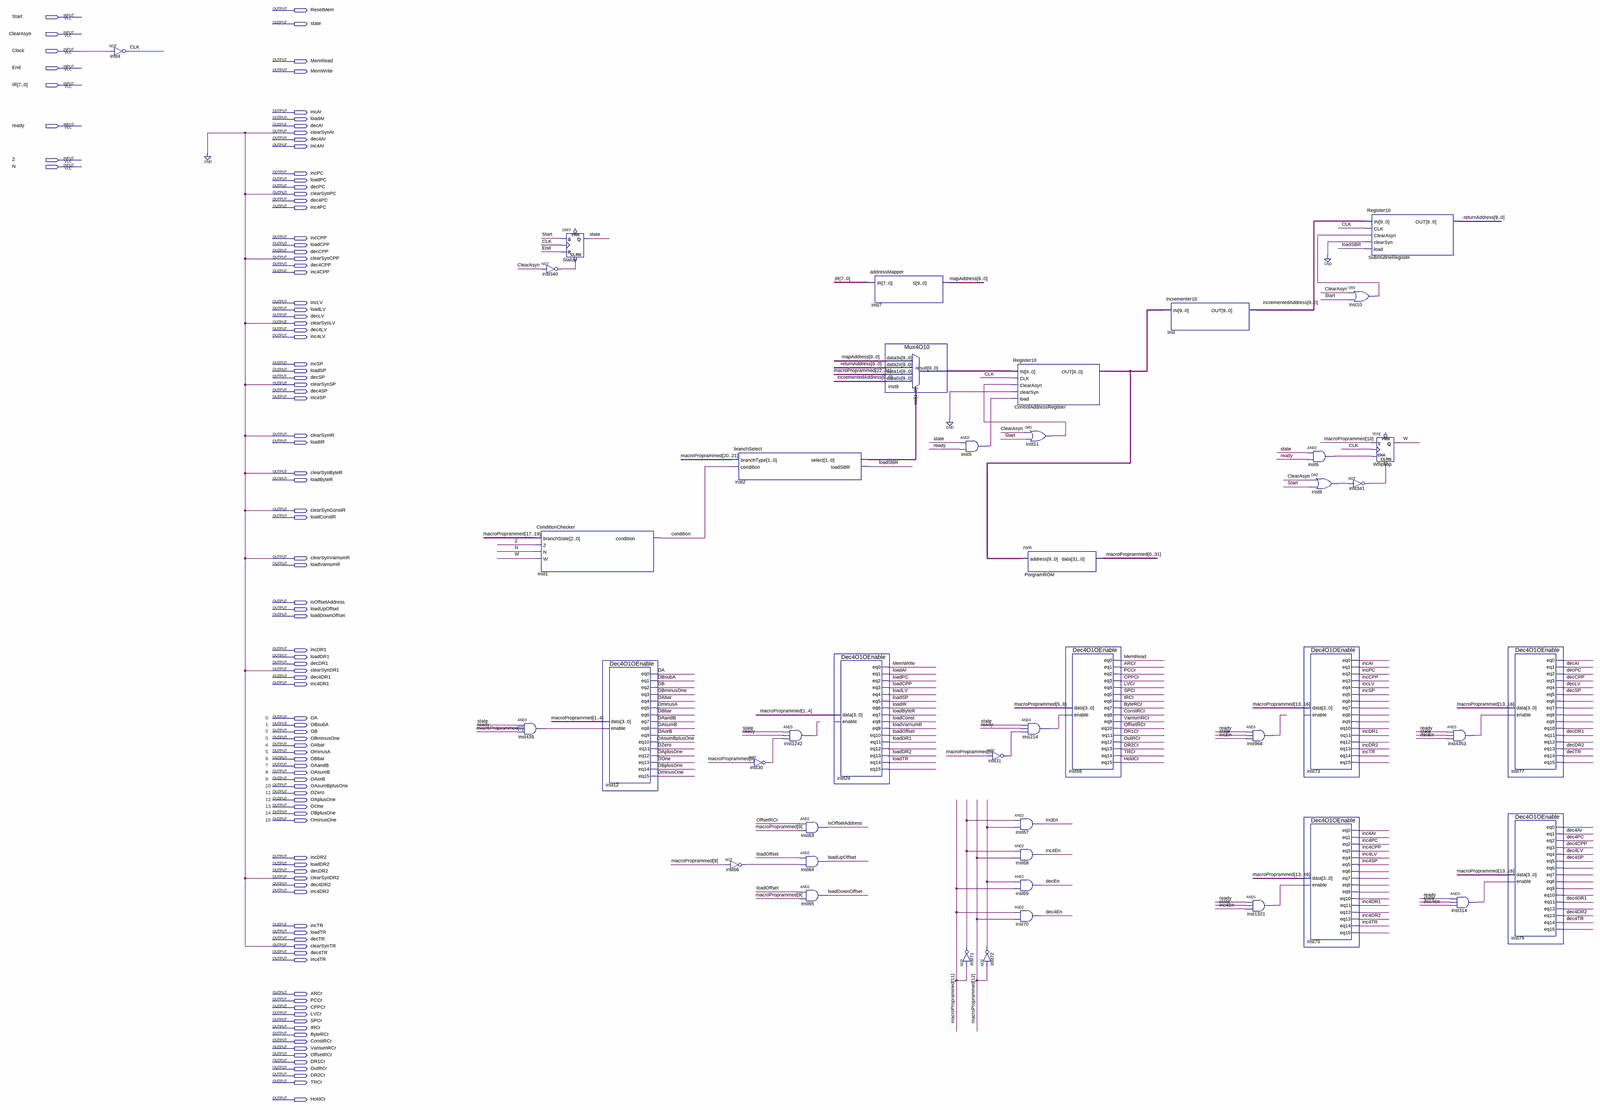
[diagram p0: schematic sheet, whole]
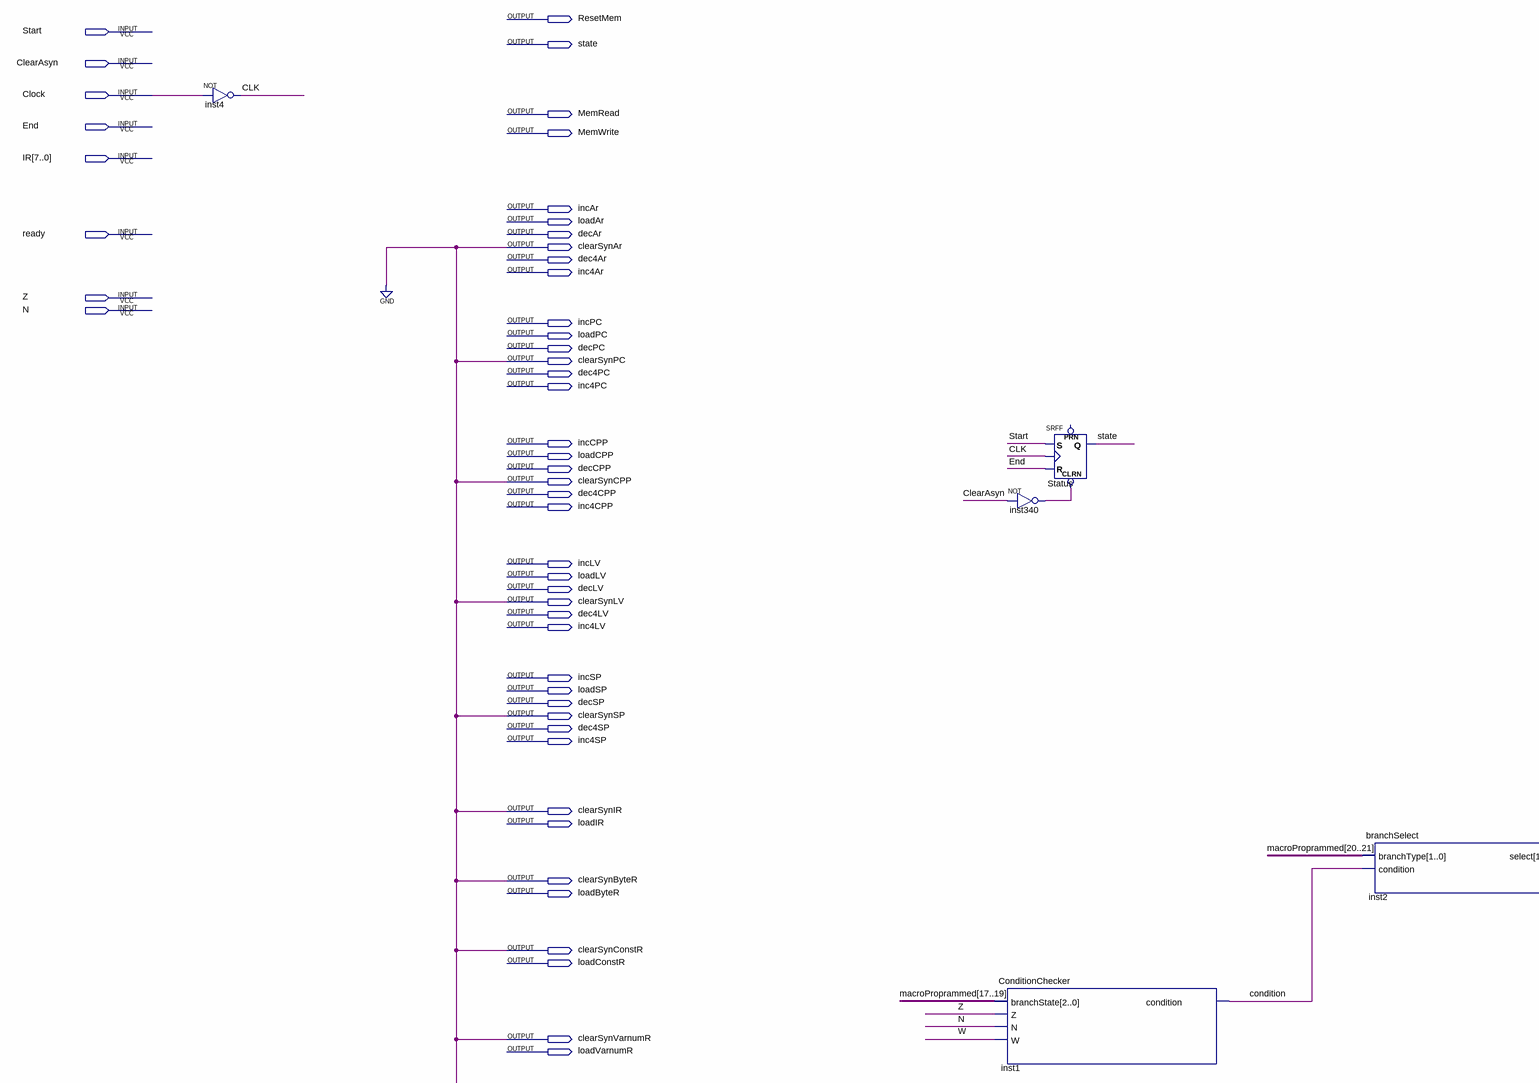
[diagram p1: schematic sheet, upper left part]
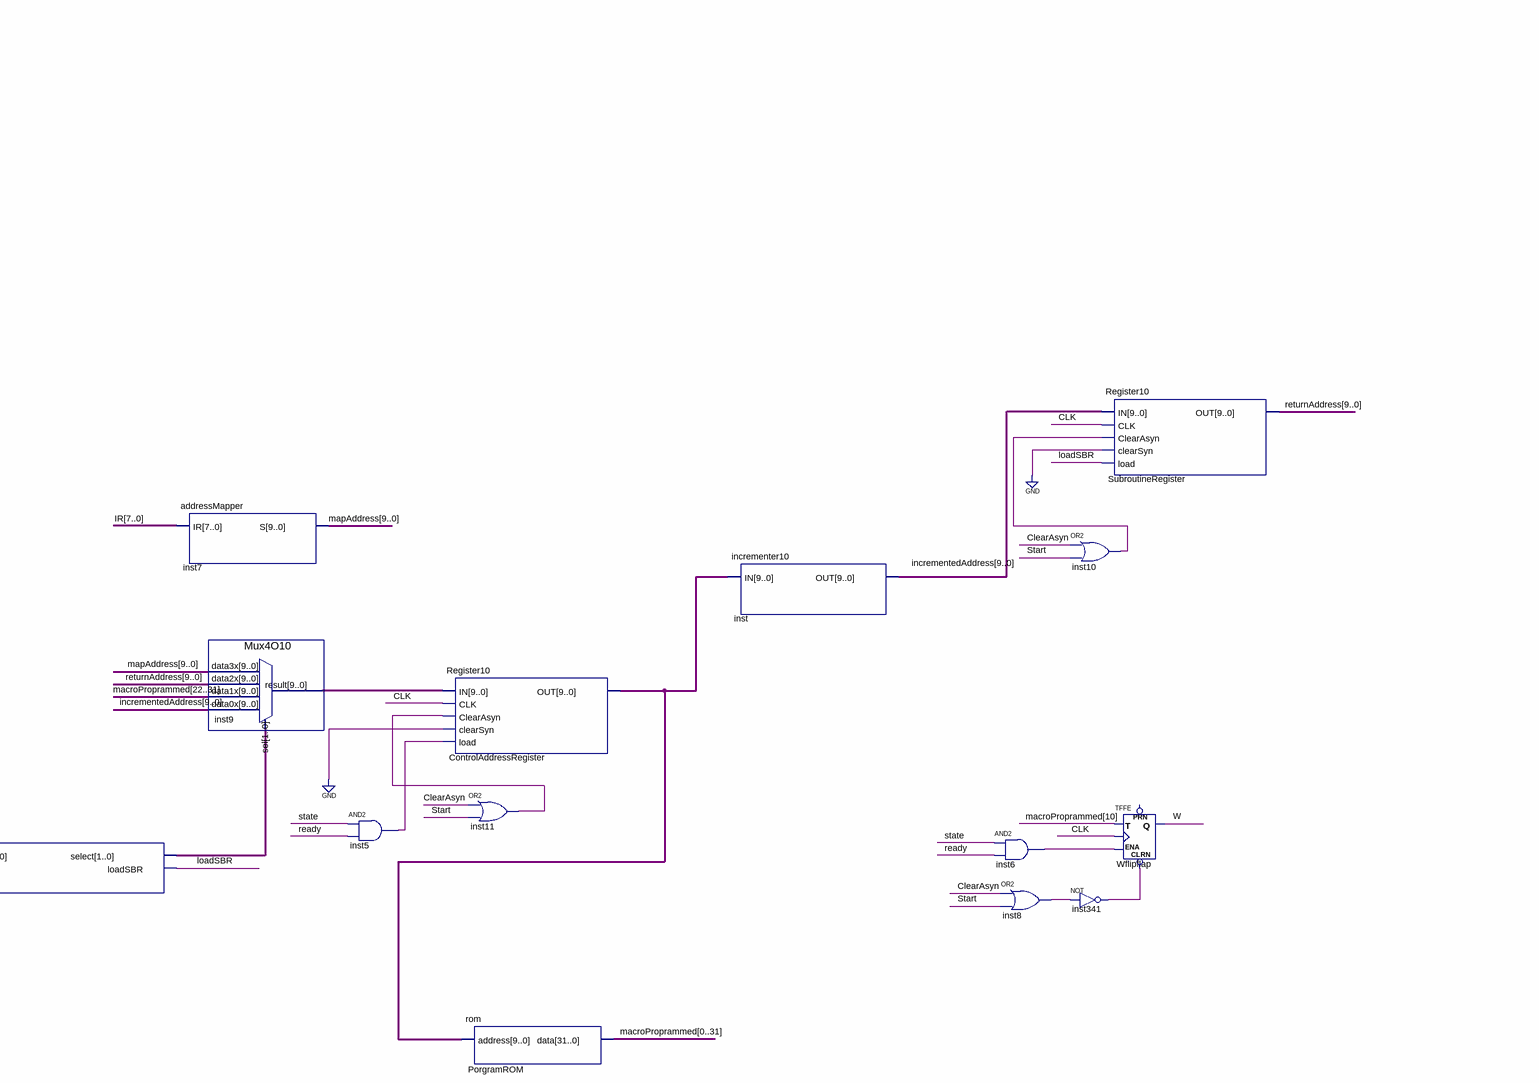
[diagram p2: schematic sheet, upper right part]
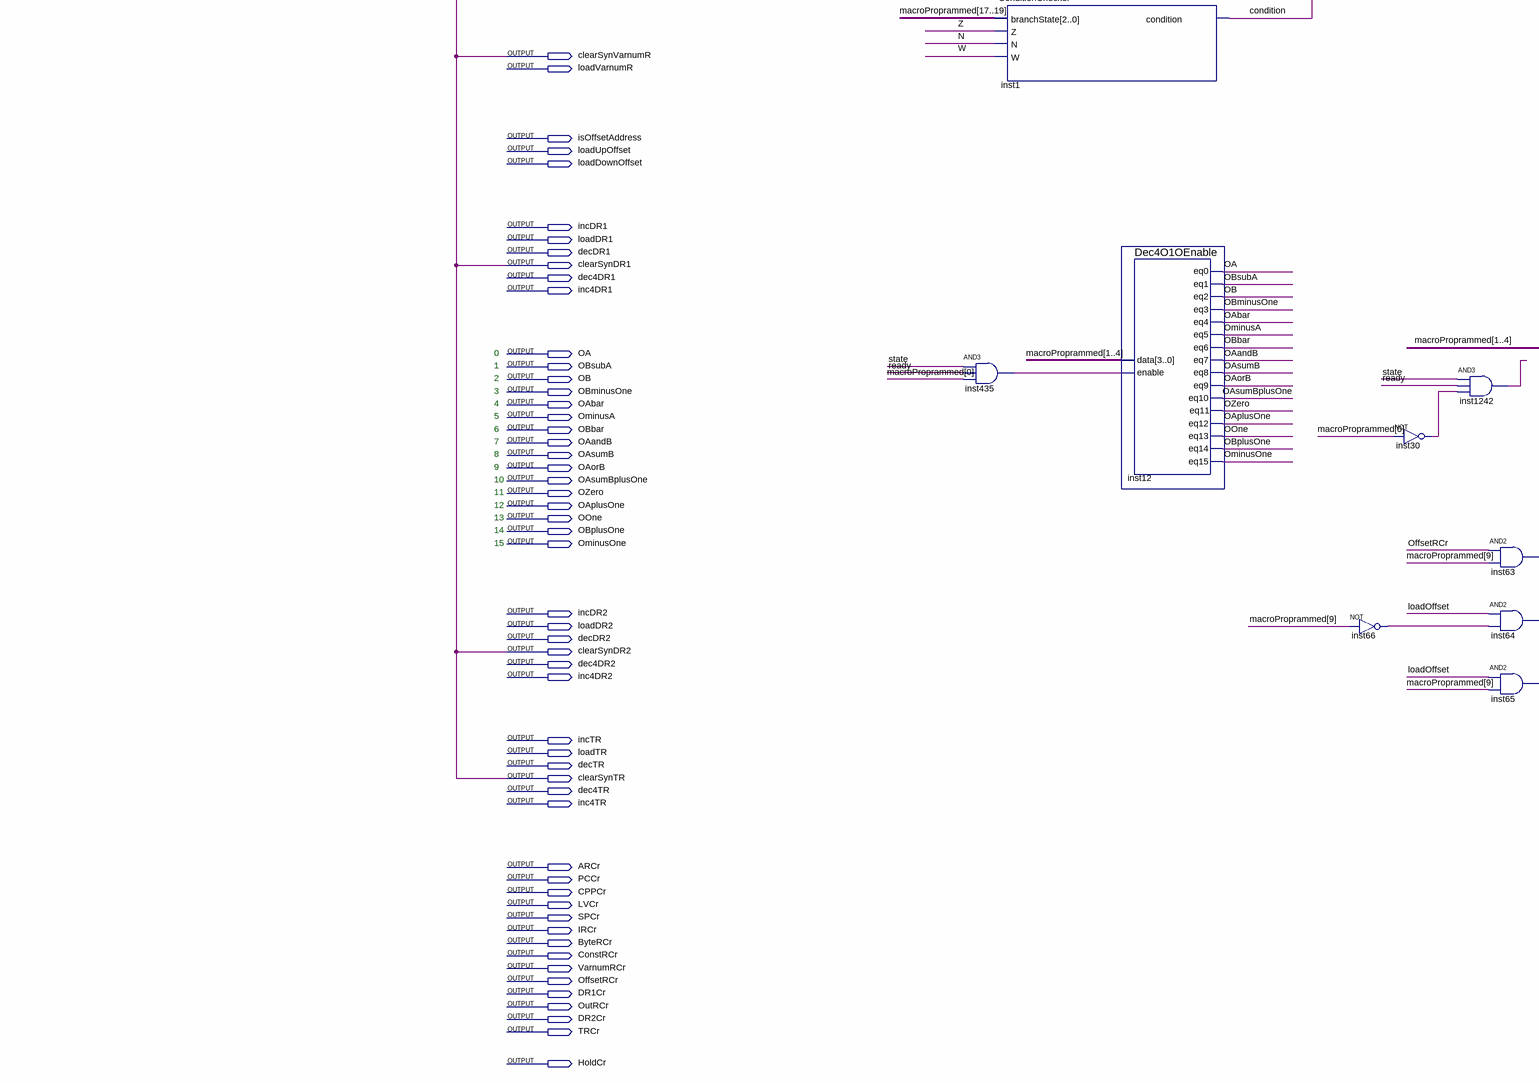
[diagram p3: schematic sheet, lower left part]
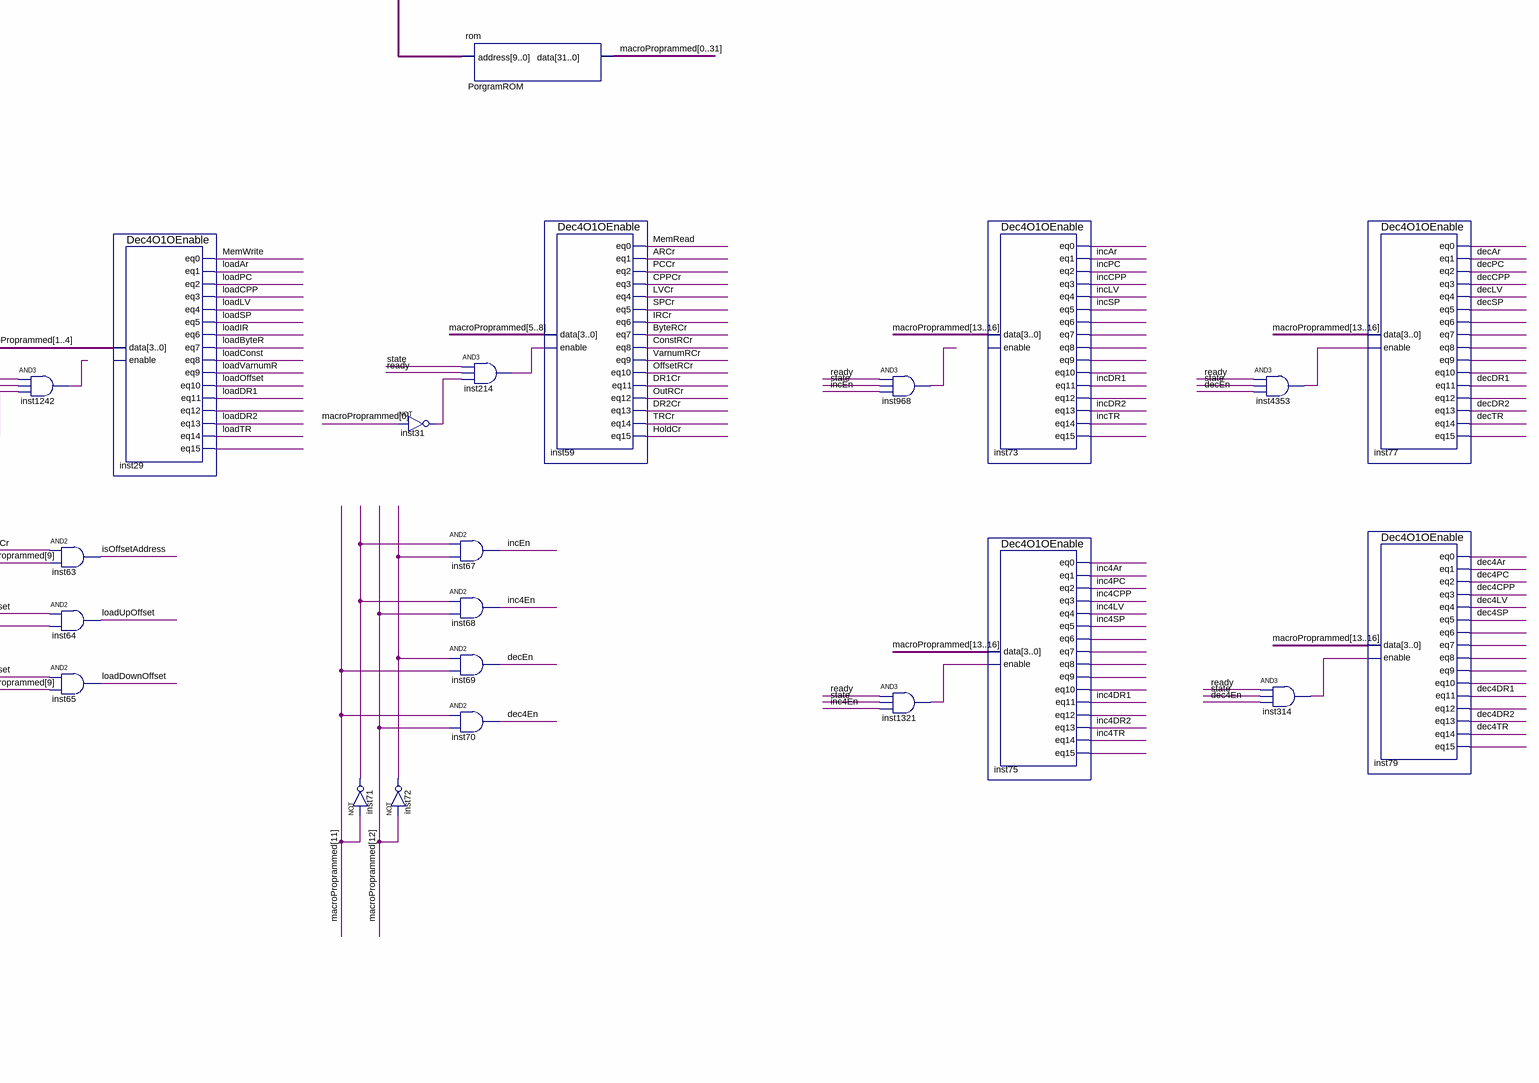
[diagram p4: schematic sheet, lower right part]
// Quartus schematic CU2.bdf as structural Verilog: 44 symbols, 102 pins
module CU2 (
  input  Start,
  input  ClearAsyn,
  input  Clock,
  input  End,
  input  [7:0] IR,
  input  ready,
  input  Z,
  input  N,
  output ResetMem,
  output state,
  output MemRead,
  output MemWrite,
  output incAr,
  output loadAr,
  output decAr,
  output clearSynAr,
  output dec4Ar,
  output inc4Ar,
  output incPC,
  output loadPC,
  output decPC,
  output clearSynPC,
  output dec4PC,
  output inc4PC,
  output incCPP,
  output loadCPP,
  output decCPP,
  output clearSynCPP,
  output dec4CPP,
  output inc4CPP,
  output incLV,
  output loadLV,
  output decLV,
  output clearSynLV,
  output dec4LV,
  output inc4LV,
  output incSP,
  output loadSP,
  output decSP,
  output clearSynSP,
  output dec4SP,
  output inc4SP,
  output clearSynIR,
  output loadIR,
  output clearSynByteR,
  output loadByteR,
  output clearSynConstR,
  output loadConstR,
  output clearSynVarnumR,
  output loadVarnumR,
  output isOffsetAddress,
  output loadUpOffset,
  output loadDownOffset,
  output incDR1,
  output loadDR1,
  output decDR1,
  output clearSynDR1,
  output dec4DR1,
  output inc4DR1,
  output OA,
  output OBsubA,
  output OB,
  output OBminusOne,
  output OAbar,
  output OminusA,
  output OBbar,
  output OAandB,
  output OAsumB,
  output OAorB,
  output OAsumBplusOne,
  output OZero,
  output OAplusOne,
  output OOne,
  output OBplusOne,
  output OminusOne,
  output incDR2,
  output loadDR2,
  output decDR2,
  output clearSynDR2,
  output dec4DR2,
  output inc4DR2,
  output incTR,
  output loadTR,
  output decTR,
  output clearSynTR,
  output dec4TR,
  output inc4TR,
  output ARCr,
  output PCCr,
  output CPPCr,
  output LVCr,
  output SPCr,
  output IRCr,
  output ByteRCr,
  output ConstRCr,
  output VarnumRCr,
  output OffsetRCr,
  output DR1Cr,
  output OutRCr,
  output DR2Cr,
  output TRCr,
  output HoldCr
);

  wire CLK, condition, dec4En, decEn, inc4En, incEn, inst5_out, inst6_out, inst8_out, inst10_out, inst11_out,
       inst29_eq12, inst29_eq15, inst30_out, inst31_out, inst66_out, inst71_out, inst72_out, inst73_eq0,
       inst73_eq6, inst73_eq7, inst73_eq8, inst73_eq9, inst73_eq10, inst73_eq12, inst73_eq15, inst75_eq0,
       inst75_eq6, inst75_eq7, inst75_eq8, inst75_eq9, inst75_eq10, inst75_eq12, inst75_eq15, inst77_eq0,
       inst77_eq6, inst77_eq7, inst77_eq8, inst77_eq9, inst77_eq10, inst77_eq12, inst77_eq15, inst79_eq0,
       inst79_eq6, inst79_eq7, inst79_eq8, inst79_eq9, inst79_eq10, inst79_eq12, inst79_eq15, inst214_out,
       inst314_out, inst340_out, inst341_out, inst435_out, inst968_out, inst1242_out, inst1321_out,
       inst4353_out, loadConst, loadOffset, loadSBR, W;
  wire [1:0] inst2_select;
  wire [9:0] ControlAddressRegister_out, incrementedAddress, inst9_result, mapAddress, returnAddress;
  wire [31:0] macroProprammed;

  not inst4 (CLK, Clock);
  not inst340 (inst340_out, ClearAsyn);
  ConditionChecker inst1 (
    .branchState({macroProprammed[17], macroProprammed[18], macroProprammed[19]}), .Z(Z), .N(N), .W(W),
    .condition(condition));
  and inst435 (inst435_out, state, ready, macroProprammed[0]);
  SRFF Status (.CLRN(inst340_out), .S(Start), .R(End), .CLK(CLK), .Q(state));  // open: PRN
  Dec4O1OEnable inst12 (
    .data({macroProprammed[1], macroProprammed[2], macroProprammed[3], macroProprammed[4]}),
    .enable(inst435_out), .eq0(OA), .eq1(OBsubA), .eq2(OB), .eq3(OBminusOne), .eq4(OAbar), .eq5(OminusA),
    .eq6(OBbar), .eq7(OAandB), .eq8(OAsumB), .eq9(OAorB), .eq10(OAsumBplusOne), .eq11(OZero),
    .eq12(OAplusOne), .eq13(OOne), .eq14(OBplusOne), .eq15(OminusOne));
  branchSelect inst2 (
    .branchType({macroProprammed[20], macroProprammed[21]}), .condition(condition), .select(inst2_select),
    .loadSBR(loadSBR));
  not inst66 (inst66_out, macroProprammed[9]);
  not inst30 (inst30_out, macroProprammed[0]);
  and inst1242 (inst1242_out, state, ready, inst30_out);
  and inst63 (isOffsetAddress, OffsetRCr, macroProprammed[9]);
  and inst64 (loadUpOffset, loadOffset, inst66_out);
  and inst65 (loadDownOffset, loadOffset, macroProprammed[9]);
  Dec4O1OEnable inst29 (
    .data({macroProprammed[1], macroProprammed[2], macroProprammed[3], macroProprammed[4]}), .eq0(MemWrite),
    .eq1(loadAr), .eq2(loadPC), .eq3(loadCPP), .eq4(loadLV), .eq5(loadSP), .eq6(loadIR), .eq7(loadByteR),
    .eq8(loadConst), .eq9(loadVarnumR), .eq10(loadOffset), .eq11(loadDR1), .eq12(inst29_eq12),
    .eq13(loadDR2), .eq14(loadTR), .eq15(inst29_eq15));  // open: enable
  addressMapper inst7 (.IR(IR), .S(mapAddress));
  Mux4O10 inst9 (
    .data3x(mapAddress), .data2x(returnAddress),
    .data1x({macroProprammed[22], macroProprammed[23], macroProprammed[24], macroProprammed[25], macroProprammed[26], macroProprammed[27], macroProprammed[28], macroProprammed[29], macroProprammed[30], macroProprammed[31]}),
    .data0x(incrementedAddress), .sel(inst2_select), .result(inst9_result));
  and inst5 (inst5_out, state, ready);
  not inst71 (inst71_out, macroProprammed[11]);
  not inst31 (inst31_out, macroProprammed[0]);
  not inst72 (inst72_out, macroProprammed[12]);
  Register10 ControlAddressRegister (
    .IN(inst9_result), .CLK(CLK), .ClearAsyn(inst11_out), .clearSyn(1'b0), .load(inst5_out),
    .OUT(ControlAddressRegister_out));
  or inst11 (inst11_out, ClearAsyn, Start);
  rom PorgramROM (
    .address(ControlAddressRegister_out),
    .data({macroProprammed[0], macroProprammed[1], macroProprammed[2], macroProprammed[3], macroProprammed[4], macroProprammed[5], macroProprammed[6], macroProprammed[7], macroProprammed[8], macroProprammed[9], macroProprammed[10], macroProprammed[11], macroProprammed[12], macroProprammed[13], macroProprammed[14], macroProprammed[15], macroProprammed[16], macroProprammed[17], macroProprammed[18], macroProprammed[19], macroProprammed[20], macroProprammed[21], macroProprammed[22], macroProprammed[23], macroProprammed[24], macroProprammed[25], macroProprammed[26], macroProprammed[27], macroProprammed[28], macroProprammed[29], macroProprammed[30], macroProprammed[31]}));
  and inst214 (inst214_out, state, ready, inst31_out);
  and inst67 (incEn, inst71_out, inst72_out);
  and inst68 (inc4En, inst71_out, macroProprammed[12]);
  and inst69 (decEn, inst72_out, macroProprammed[11]);
  and inst70 (dec4En, macroProprammed[11], macroProprammed[12]);
  Dec4O1OEnable inst59 (
    .data({macroProprammed[5], macroProprammed[6], macroProprammed[7], macroProprammed[8]}),
    .enable(inst214_out), .eq0(MemRead), .eq1(ARCr), .eq2(PCCr), .eq3(CPPCr), .eq4(LVCr), .eq5(SPCr),
    .eq6(IRCr), .eq7(ByteRCr), .eq8(ConstRCr), .eq9(VarnumRCr), .eq10(OffsetRCr), .eq11(DR1Cr),
    .eq12(OutRCr), .eq13(DR2Cr), .eq14(TRCr), .eq15(HoldCr));
  incrementer10 inst (.IN(ControlAddressRegister_out), .OUT(incrementedAddress));
  and inst968 (inst968_out, ready, state, incEn);
  and inst1321 (inst1321_out, ready, state, inc4En);
  Dec4O1OEnable inst73 (
    .data({macroProprammed[13], macroProprammed[14], macroProprammed[15], macroProprammed[16]}),
    .eq0(inst73_eq0), .eq1(incAr), .eq2(incPC), .eq3(incCPP), .eq4(incLV), .eq5(incSP), .eq6(inst73_eq6),
    .eq7(inst73_eq7), .eq8(inst73_eq8), .eq9(inst73_eq9), .eq10(inst73_eq10), .eq11(incDR1),
    .eq12(inst73_eq12), .eq13(incDR2), .eq14(incTR), .eq15(inst73_eq15));  // open: enable
  Dec4O1OEnable inst75 (
    .data({macroProprammed[13], macroProprammed[14], macroProprammed[15], macroProprammed[16]}),
    .enable(inst1321_out), .eq0(inst75_eq0), .eq1(inc4Ar), .eq2(inc4PC), .eq3(inc4CPP), .eq4(inc4LV),
    .eq5(inc4SP), .eq6(inst75_eq6), .eq7(inst75_eq7), .eq8(inst75_eq8), .eq9(inst75_eq9), .eq10(inst75_eq10),
    .eq11(inc4DR1), .eq12(inst75_eq12), .eq13(inc4DR2), .eq14(inc4TR), .eq15(inst75_eq15));
  and inst6 (inst6_out, state, ready);
  or inst8 (inst8_out, ClearAsyn, Start);
  or inst10 (inst10_out, ClearAsyn, Start);
  not inst341 (inst341_out, inst8_out);
  Register10 SubroutineRegister (
    .IN(incrementedAddress), .CLK(CLK), .ClearAsyn(inst10_out), .clearSyn(1'b0), .load(loadSBR),
    .OUT(returnAddress));
  TFFE Wflipflap (.CLRN(inst341_out), .T(macroProprammed[10]), .CLK(CLK), .ENA(inst6_out), .Q(W));  // open: PRN
  and inst4353 (inst4353_out, ready, state, decEn);
  and inst314 (inst314_out, ready, state, dec4En);
  Dec4O1OEnable inst77 (
    .data({macroProprammed[13], macroProprammed[14], macroProprammed[15], macroProprammed[16]}),
    .enable(inst4353_out), .eq0(inst77_eq0), .eq1(decAr), .eq2(decPC), .eq3(decCPP), .eq4(decLV),
    .eq5(decSP), .eq6(inst77_eq6), .eq7(inst77_eq7), .eq8(inst77_eq8), .eq9(inst77_eq9), .eq10(inst77_eq10),
    .eq11(decDR1), .eq12(inst77_eq12), .eq13(decDR2), .eq14(decTR), .eq15(inst77_eq15));
  Dec4O1OEnable inst79 (
    .data({macroProprammed[13], macroProprammed[14], macroProprammed[15], macroProprammed[16]}),
    .enable(inst314_out), .eq0(inst79_eq0), .eq1(dec4Ar), .eq2(dec4PC), .eq3(dec4CPP), .eq4(dec4LV),
    .eq5(dec4SP), .eq6(inst79_eq6), .eq7(inst79_eq7), .eq8(inst79_eq8), .eq9(inst79_eq9), .eq10(inst79_eq10),
    .eq11(dec4DR1), .eq12(inst79_eq12), .eq13(dec4DR2), .eq14(dec4TR), .eq15(inst79_eq15));

  assign clearSynAr = 1'b0;
  assign clearSynByteR = 1'b0;
  assign clearSynConstR = 1'b0;
  assign clearSynCPP = 1'b0;
  assign clearSynDR1 = 1'b0;
  assign clearSynDR2 = 1'b0;
  assign clearSynIR = 1'b0;
  assign clearSynLV = 1'b0;
  assign clearSynPC = 1'b0;
  assign clearSynSP = 1'b0;
  assign clearSynTR = 1'b0;
  assign clearSynVarnumR = 1'b0;

  // Notes on the sheet:
  //   0
  //   1
  //   2
  //   3
  //   4
  //   5
  //   6
  //   7
  //   8
  //   9
  //   10
  //   11
  //   12
  //   13
  //   14
  //   15
endmodule
